# Altium schematic sheet CANbus.SchDoc: CANbus Module
size A4; Author: Nikola Rašević; Organization: Memristor Robotics
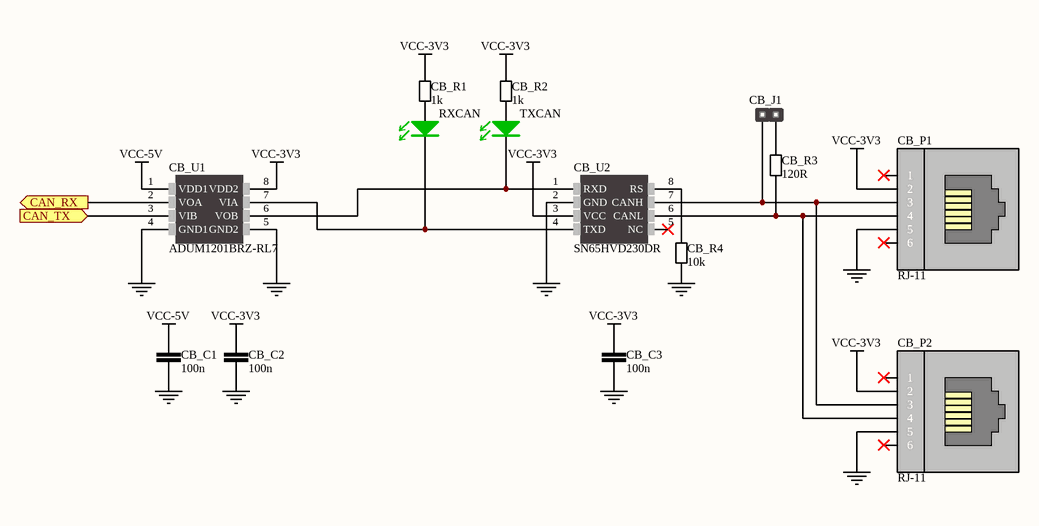
[diagram p0: CANbus.SchDoc]

## Parts
CB_C1  100n  [CER_0603]
CB_C2  100n  [CER_0603]
CB_C3  100n  [CER_0603]
CB_J1  *  [HM1x2]  (value not drawn)
CB_P1  RJ-11  [RJ11-6N-B]
CB_P2  RJ-11  [RJ11-6N-B]
CB_R1  1k  [RESC2013X38N-0805-NOOVERLAY]
CB_R2  1k  [RESC2013X38N-0805-NOOVERLAY]
CB_R3  120R  [RESC2013X38N-0805-NOOVERLAY]
CB_R4  10k  [RESC2013X38N-0805-NOOVERLAY]
CB_U1  ADUM1201BRZ-RL7  [SOIC-8]
CB_U2  SN65HVD230DR  [SOIC-8]
RXCAN  LED GREEN  [LED_GREEN_0805]  (value not drawn)
TXCAN  LED GREEN  [LED_GREEN_0805]  (value not drawn)

## Ports
CAN_RX (out), CAN_TX (in)

## Nets
GND: CB_C1.1 CB_C2.1 CB_C3.1 CB_P1.5 CB_P2.5 CB_R4.1 CB_U1.4(GND1) CB_U1.5(GND2) CB_U2.2(GND)
VCC-3V3: CB_C2.2 CB_C3.2 CB_P1.2 CB_P2.2 CB_R1.2 CB_R2.2 CB_U1.8(VDD2) CB_U2.3(VCC)
VCC-5V: CB_C1.2 CB_U1.1(VDD1)
CAN_RX: CB_U1.2(VOA) ; port CAN_RX
CAN_TX: CB_U1.3(VIB) ; port CAN_TX
NetCB_J1_1: CB_J1.1 CB_P1.3 CB_P2.3 CB_U2.7(CANH)
NetCB_J1_2: CB_J1.2 CB_R3.2
NetCB_P1_4: CB_P1.4 CB_P2.4 CB_R3.1 CB_U2.6(CANL)
NetCB_R1_1: CB_R1.1 RXCAN.2(A)
NetCB_R2_1: CB_R2.1 TXCAN.2(A)
NetCB_R4_2: CB_R4.2 CB_U2.8(RS)
NetCB_U1_6: CB_U1.6(VOB) CB_U2.1(RXD) TXCAN.1(C)
NetCB_U1_7: CB_U1.7(VIA) CB_U2.4(TXD) RXCAN.1(C)

Not connected (* = marked no-connect by the designer): CB_P1 1* 6*; CB_P2 1* 6*; CB_U2 5(NC)*

## Notes on the sheet
- Title
- Date:
- Design Engineer:
- Time:
- Revision:
- Sheet
- of
- Size:
- A4
- www.memristor-robotics.io
- File:

## Library data of the parts
CB_C1-CB_C3 = 06032105: CAP CER 100n 10V X5R 10% 0603; Capacitance: 100n
CB_J1 = HEADER_1x2: Manufacturer Part Number: *
CB_P1 CB_P2 = 00000001: Manufacturer Part Number: RJ-11
CB_R1 CB_R2 = 00001001: RES SMD 1 kOhm 1/8W 0805; Power: 0.125W, 1/8W; Barcode: 00009101; Resistance: 1k; Assembly: SMD
CB_R3 = 000001200: RES SMD 120 Ohm 1/8W 0805; Resistance: 120R
CB_R4 = 000001002: RES SMD 10 kOhm 1/8W 0805; Resistance: 10k
CB_U1 = ADUM1201BRZ: DGTL ISO 2.5KV GEN PURP 8SOIC; Assembly: SMD; Barcode: 00000001; Manufacturer Part Number: ADUM1201BRZ-RL7; Datasheet Link: http://www.analog.com/media/en/technical-documentation/data-sheets/ADuM1200_1201.pdf; Category: Integrated Circuits (ICs); Package: SOIC-8; Family: Comunication
CB_U2 = SN65HVD230: IC EMC CAN TRANSCEIVER 8-SOIC; Assembly: SMD; Barcode: 00000001; Manufacturer Part Number: SN65HVD230DR; Comet Product Page: http://store.comet.rs/Catalogue/Product/9057/; Datasheet Link: http://www.ti.com/lit/ds/symlink/sn65hvd232.pdf; Category: Integrated Circuits (ICs); Package: SOIC-8; Family: Comunication
RXCAN TXCAN = LED_GREEN 0805: LED GREEN CLEAR 0805 SMD; Manufacturer: Kingbright; Manufacturer Part Number: APT2012SGC; Barcode: 2911010024338; id: 28; Voltage Forward: 2.2V; Wavelength: 568nm; Lens Color: Colorless; item_id: 3342; Recommended Rating: Platinum; Category: Optoelectronics; Assembly: SMD; Datasheet URL: http://www.kingbrightusa.com/images/catalog/SPEC/APT2012SGC.pdf; Package Case: 0805 (2012 Metric); Color: Green; Family: LED; Lens Transparency: Clear; Part Type: Optoelectronics